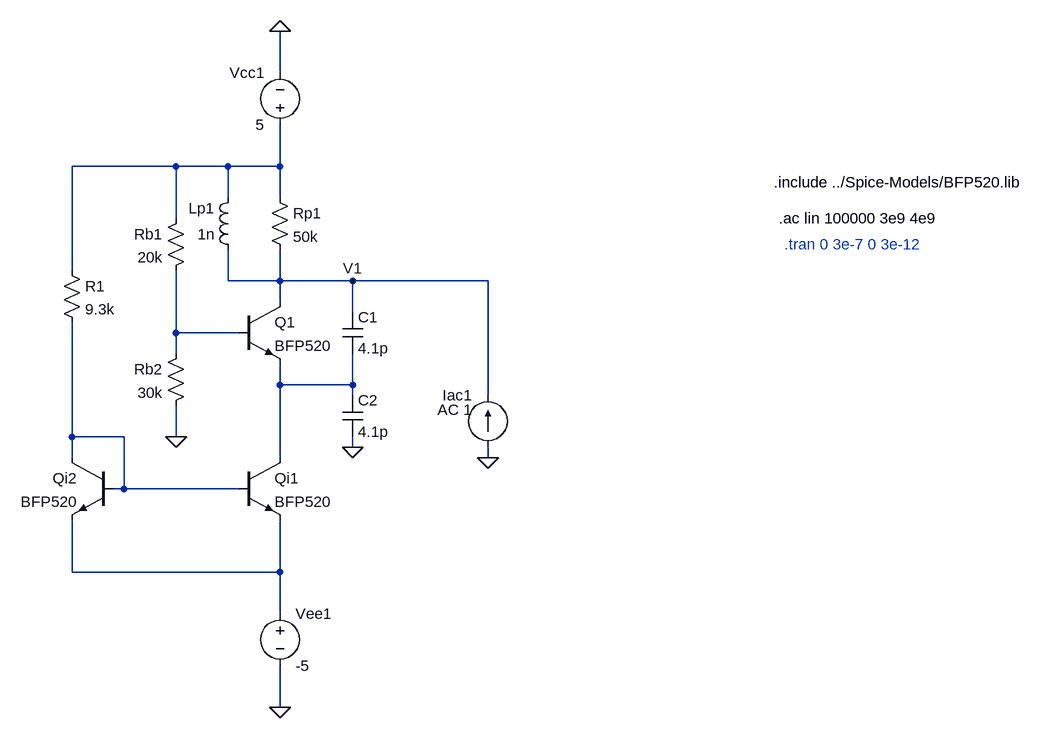
[diagram p0: schematic Input-Impedance.asc]
Input-Impedance.asc, the LTspice schematic file:
Version 4
SHEET 1 1220 896
WIRE 80 -96 80 -160
WIRE -80 48 -240 48
WIRE 0 48 -80 48
WIRE 80 48 80 -16
WIRE 80 48 0 48
WIRE 0 96 0 48
WIRE 80 96 80 48
WIRE -80 128 -80 48
WIRE -240 208 -240 48
WIRE 0 224 0 176
WIRE 80 224 80 176
WIRE 80 224 0 224
WIRE 192 224 80 224
WIRE 400 224 192 224
WIRE 80 256 80 224
WIRE 192 272 192 224
WIRE -80 304 -80 208
WIRE 16 304 -80 304
WIRE -80 336 -80 304
WIRE 80 384 80 352
WIRE 192 384 192 336
WIRE 192 384 80 384
WIRE 192 400 192 384
WIRE 400 400 400 224
WIRE -240 464 -240 288
WIRE -160 464 -240 464
WIRE -80 464 -80 416
WIRE 192 480 192 464
WIRE -240 496 -240 464
WIRE 80 496 80 384
WIRE 400 496 400 480
WIRE -160 544 -160 464
WIRE -160 544 -176 544
WIRE 16 544 -160 544
WIRE -240 672 -240 592
WIRE 80 672 80 592
WIRE 80 672 -240 672
WIRE 80 736 80 672
WIRE 80 880 80 816
FLAG 80 -160 0
FLAG 80 880 0
FLAG -80 464 0
FLAG 400 496 0
FLAG 192 480 0
FLAG 192 224 V1
SYMBOL npn 16 256 R0
SYMATTR InstName Q1
SYMATTR Value BFP520
SYMBOL ind 16 192 R180
WINDOW 0 36 80 Left 2
WINDOW 3 36 40 Left 2
SYMATTR InstName Lp1
SYMATTR Value 1n
SYMBOL Res 64 80 R0
SYMATTR InstName Rp1
SYMATTR Value 50k
SYMBOL Voltage 80 0 R180
WINDOW 0 24 96 Left 2
WINDOW 3 24 16 Left 2
SYMATTR InstName Vcc1
SYMATTR Value 5
SYMBOL npn 16 496 R0
SYMATTR InstName Qi1
SYMATTR Value BFP520
SYMBOL npn -176 496 M0
SYMATTR InstName Qi2
SYMATTR Value BFP520
SYMBOL Res -256 192 R0
SYMATTR InstName R1
SYMATTR Value 9.3k
SYMBOL Voltage 80 720 R0
SYMATTR InstName Vee1
SYMATTR Value -5
SYMBOL Res -64 112 M0
SYMATTR InstName Rb1
SYMATTR Value 20k
SYMBOL Res -64 320 M0
SYMATTR InstName Rb2
SYMATTR Value 30k
SYMBOL current 400 480 R180
WINDOW 0 24 80 Left 2
WINDOW 3 24 0 Left 2
WINDOW 123 24 58 Left 2
SYMATTR InstName Iac1
SYMATTR Value ""
SYMATTR Value2 AC 1
SYMBOL cap 176 272 R0
SYMATTR InstName C1
SYMATTR Value 4.1p
SYMBOL cap 176 400 R0
SYMATTR InstName C2
SYMATTR Value 4.1p
TEXT 840 72 Left 2 !.include ../Spice-Models/BFP520.lib
TEXT 848 128 Left 2 !.ac lin 100000 3e9 4e9
TEXT 856 168 Left 2 ;.tran 0 3e-7 0 3e-12

The netlist it stands for:
* Input-Impedance.asc
Q1 V1 N002 N003 0 BFP520
Lp1 V1 N001 1n
Rp1 N001 V1 50k
Vcc1 N001 0 5
Qi1 N003 N004 N005 0 BFP520
Qi2 N004 N004 N005 0 BFP520
R1 N001 N004 9.3k
Vee1 N005 0 -5
Rb1 N001 N002 20k
Rb2 N002 0 30k
Iac1 0 V1 AC 1
C1 V1 N003 4.1p
C2 N003 0 4.1p
.model NPN NPN
.model PNP PNP
.lib standard.bjt
.include ../Spice-Models/BFP520.lib
.ac lin 100000 3e9 4e9
* .tran 0 3e-7 0 3e-12
.backanno
.end